# Altium schematic sheet USB_TO_UART_.SchDoc
size A4; SheetNumber: 1; SheetTotal: 1
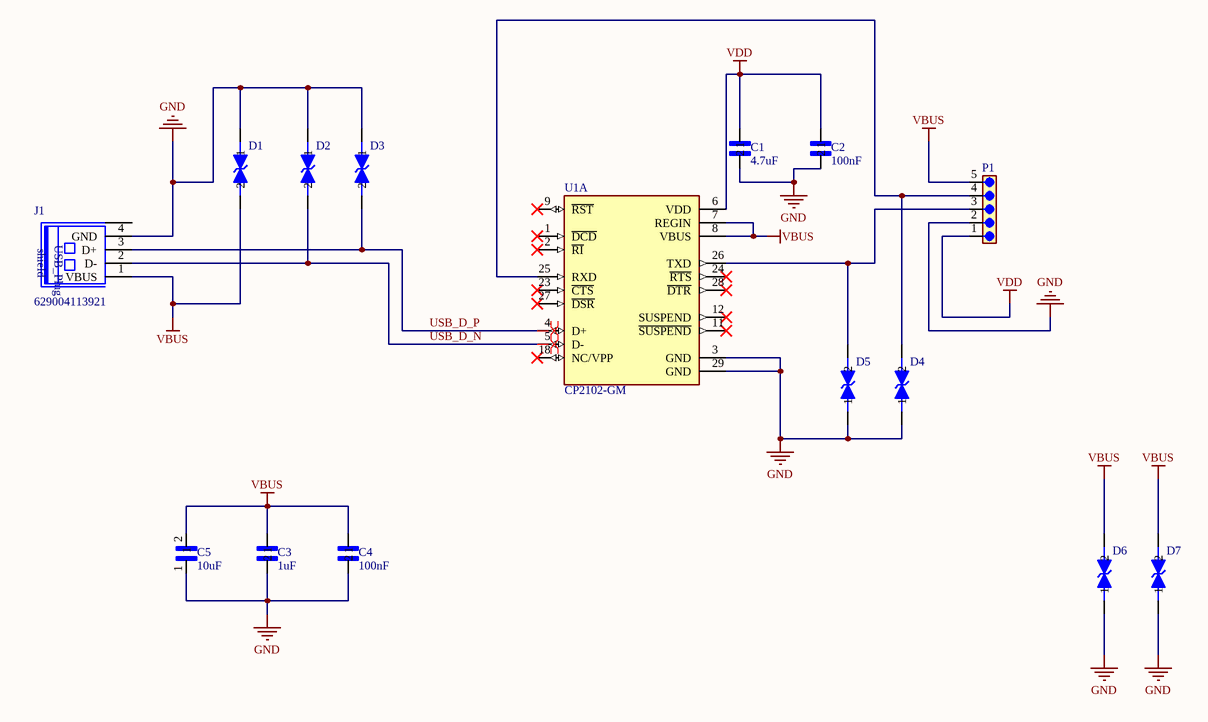
[diagram p0: USB_TO_UART_.SchDoc]

## Parts
C1  4.7uF  [CAPC1005X65N]
C2  100nF  [CAPC1005X55N]
C3  1uF  [CAPC1005X55N]
C4  100nF  [CAPC1005X55N]
C5  10uF  [CAPC1608X90N]
D1  (no value)  [DIO_TPD1E10B06DPYR]
D2  (no value)  [DIO_TPD1E10B06DPYR]
D3  (no value)  [DIO_TPD1E10B06DPYR]
D4  (no value)  [DIO_TPD1E10B06DPYR]
D5  (no value)  [DIO_TPD1E10B06DPYR]
D6  (no value)  [DIO_TPD1E10B06DPYR]
D7  (no value)  [DIO_TPD1E10B06DPYR]
J1  629004113921  [629004113921]
P1  (no value)  [61300511021]
U1A  CP2102-GM  [QFN50P500X500X100-29N]

## Nets
GND: C1.1 C2.1 C3.1 C4.1 C5.1 D1.1 D2.1 D3.1 D4.1 D5.1 D6.1 D7.1 J1.4(GND) P1.2 U1A.3(GND) U1A.29(GND)
VBUS: C3.2 C4.2 C5.2 D1.2 D6.2 D7.2 J1.1(VBUS) P1.5 U1A.7(REGIN) U1A.8(VBUS)
VDD: C1.2 C2.2 P1.1 U1A.6(VDD)
USB_D_N: D2.2 J1.2(D-) U1A.5(D-)
USB_D_P: D3.2 J1.3(D+) U1A.4(D+)
NetD4_2: D4.2 P1.4 U1A.25(RXD)
NetD5_2: D5.2 P1.3 U1A.26(TXD)
NetJ1_S1: J1.S1(SHIELD) J1.S2(SHIELD)

Not connected (* = marked no-connect by the designer): U1A 1(~{DCD})* 2(~{RI})* 9(~{RST})* 11(~{SUSPEND})* 12(SUSPEND)* 18(NC/VPP)* 23(~{CTS})* 24(~{RTS})* 27(~{DSR})* 28(~{DTR})*

## Layout directives
differential pair: USB_D_N, USB_D_P

## Notes on the sheet
- (in symbol 629004113921) USB_Plug; shield

## Library data of the parts
C1 = C1005X5R1A475K050BC: Capacitance:4.7ÂµF; Voltage(DC):10V; Capacitor Case / Package:0402 [1005 Metric]; Capacitance Tolerance:Â± 10%; Dielectric Characteristic:X5R; Product Range:C Series; Product Length:1.02mm; Product Width:0.5mm; Qualification:- RoHS Compliant: Yes; MF: TDK; MP: C1005X5R1A475K050BC.; SnapEDA_Link: https://www.snapeda.com/parts/C1005X5R1A475K050BC./TDK/view-part/?ref=snap; Package: 1005-2 TDK; Value: *; Check_prices: https://www.snapeda.com/parts/C1005X5R1A475K050BC./TDK/view-part/?ref=eda
C2 C4 = CC0402KRX7R7BB104: 0.1 ÂµF Â±10% 16V Ceramic Capacitor X7R 0402 (1005 Metric); MF: Yageo; SnapEDA_Link: https://www.snapeda.com/parts/CC0402KRX7R7BB104/Yageo/view-part/?ref=snap; Package: 0402 Yageo; Value: *; MP: CC0402KRX7R7BB104; Check_prices: https://www.snapeda.com/parts/CC0402KRX7R7BB104/Yageo/view-part/?ref=eda
C3 = C0402C105K8PACTU: 1 ÂµF Â±10% 10V Ceramic Capacitor X5R 0402 (1005 Metric); MF: KEMET; SnapEDA_Link: https://www.snapeda.com/parts/C0402C105K8PACTU/KEMET/view-part/?ref=snap; Package: 0402 Kemet; Value: *; MP: C0402C105K8PACTU; Check_prices: https://www.snapeda.com/parts/C0402C105K8PACTU/KEMET/view-part/?ref=eda
C5 = C1608X5R1A106K080AC: 10ÂµF Â±10% 10V Ceramic Capacitor X5R 0603 (1608 Metric); MF: TDK; SnapEDA_Link: https://www.snapeda.com/parts/C1608X5R1A106K080AC/TDK-Lambda+Americas+Inc/view-part/?ref=snap; Package: 1608 TDK; MP: C1608X5R1A106K080AC; Value: *; Purchase-URL: https://pricing.snapeda.com/search/part/C1608X5R1A106K080AC/?ref=eda; Check_prices: https://www.snapeda.com/parts/C1608X5R1A106K080AC/TDK-Lambda+Americas+Inc/view-part/?ref=eda; Availability: In Stock; Price: None
D1-D7 = TPD1E10B06DPYR: 12-pF, Â±5.5V, Â±30-kV ESD protection diode in 0402 and SOD-523 package; MF: Texas Instruments; SnapEDA_Link: https://www.snapeda.com/parts/TPD1E10B06DPYR/Texas+Instruments/view-part/?ref=snap; Package: X1SON-2 Texas Instruments; Value: *; MP: TPD1E10B06DPYR; Check_prices: https://www.snapeda.com/parts/TPD1E10B06DPYR/Texas+Instruments/view-part/?ref=eda
J1 = 629004113921: Type A Plug Horizontal SMT - with Clips; MF: Wurth Electronics; SnapEDA_Link: https://www.snapeda.com/parts/629004113921/Wurth+Electronics/view-part/?ref=snap; Package: None; Value: *; MP: 629004113921; Check_prices: https://www.snapeda.com/parts/629004113921/Wurth+Electronics/view-part/?ref=eda
P1 = 6130XX11021_61300511021: 5 pins, 1 row, right angled, gold plating; MF: Wurth Electronics; SnapEDA_Link: https://www.snapeda.com/parts/61300511021/Wurth+Electronics/view-part/?ref=snap; Package: None; Value: *; MP: 61300511021; Check_prices: https://www.snapeda.com/parts/61300511021/Wurth+Electronics/view-part/?ref=eda
U1A = CP2102-GM: USB Bridge, USB to UART USB 2.0 UART Interface 28-QFN (5x5); MF: Silicon Labs; SnapEDA_Link: https://www.snapeda.com/parts/CP2102-GM/Silicon+Labs/view-part/?ref=snap; Package: QFN-28 Silicon Labs; Value: *; MP: CP2102-GM; Check_prices: https://www.snapeda.com/parts/CP2102-GM/Silicon+Labs/view-part/?ref=eda